# EAGLE design IR4427 (EAGLE 9.5.1)
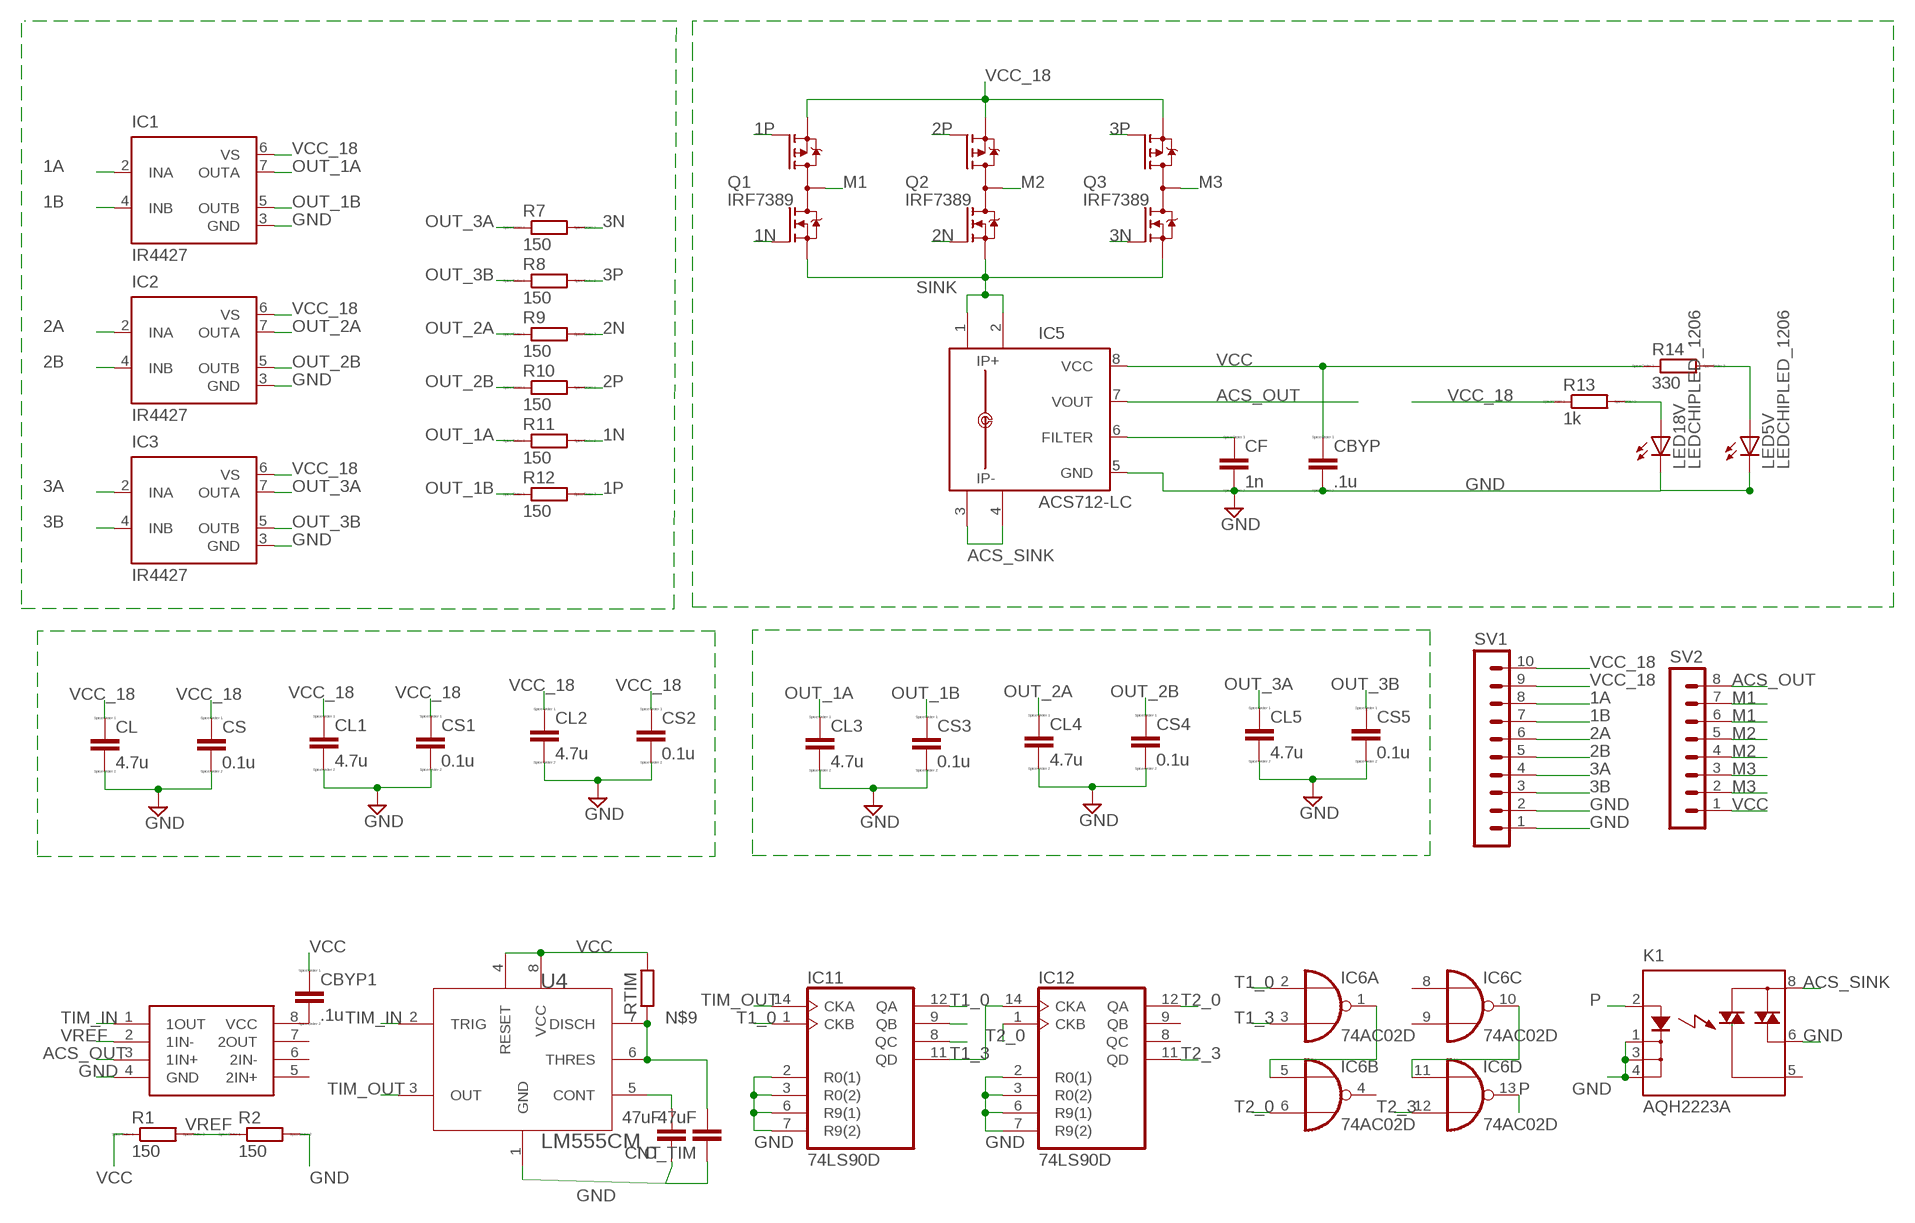
[diagram p0: schematic, sheet 1]

## Parts
C_TIM  47uF  C-EUC1206  [C1206]
CBYP  .1u  CC1206  [C1206]
CBYP1  .1u  CC1206  [C1206]
CF  1n  CC1206  [C1206]
CL  4.7u  CC1206  [C1206]
CL1  4.7u  CC1206  [C1206]
CL2  4.7u  CC1206  [C1206]
CL3  4.7u  CC1206  [C1206]
CL4  4.7u  CC1206  [C1206]
CL5  4.7u  CC1206  [C1206]
CNT  47uF  C-EUC1206  [C1206]
CS  0.1u  CC1206  [C1206]
CS1  0.1u  CC1206  [C1206]
CS2  0.1u  CC1206  [C1206]
CS3  0.1u  CC1206  [C1206]
CS4  0.1u  CC1206  [C1206]
CS5  0.1u  CC1206  [C1206]
IC1  IR4427  [DIL08]
IC2  IR4427  [DIL08]
IC3  IR4427  [DIL08]
IC5  ACS712-LC  [SOIC8]
IC6  74AC02D  [SO14]
IC11  74LS90D  [SO14]
IC12  74LS90D  [SO14]
K1  AQH2223A  [DIL07SMD]
LED5V  LEDCHIPLED_1206  [CHIPLED_1206]
LED18V  LEDCHIPLED_1206  [CHIPLED_1206]
Q1  IRF7389  [SO08-IRF]
Q2  IRF7389  [SO08-IRF]
Q3  IRF7389  [SO08-IRF]
R1  150  RR1206  [R1206]
R2  150  RR1206  [R1206]
R7  150  RR1206  [R1206]
R8  150  RR1206  [R1206]
R9  150  RR1206  [R1206]
R10  150  RR1206  [R1206]
R11  150  RR1206  [R1206]
R12  150  RR1206  [R1206]
R13  1k  RR1206  [R1206]
R14  330  RR1206  [R1206]
RTIM  R-EU_R1206  [R1206]
SV1  MA10-1  [MA10-1]
SV2  MA08-1  [MA08-1]
U1  LM293D  [8-SOIC]
U4  LM555CM  [SOIC-8N]

## Nets
1A [signal]: IC1.2(INA) SV1.8
1B [signal]: IC1.4(INB) SV1.7
1N [signal]: Q1.2(N-G) R11.2
1P [signal]: Q1.4(P-G) R12.2
2A [signal]: IC2.2(INA) SV1.6
2B [signal]: IC2.4(INB) SV1.5
2N [signal]: Q2.2(N-G) R9.2
2P [signal]: Q2.4(P-G) R10.2
3A [signal]: IC3.2(INA) SV1.4
3B [signal]: IC3.4(INB) SV1.3
3N [signal]: Q3.2(N-G) R7.2
3P [signal]: Q3.4(P-G) R8.2
ACS_OUT [signal]: IC5.7(VOUT) SV2.8 U1.3(1IN+)
ACS_SINK [gnd]: IC5.3(IP-) IC5.4(IP-1) K1.8(DS1)
GND [gnd]: C_TIM.1 CBYP.2 CF.2 CL1.2 CL2.2 CL3.2 CL4.2 CL5.2 CL.2 CNT.1 CS1.2 CS2.2 CS3.2 CS4.2 CS5.2 CS.2 IC1.3(GND) IC2.3(GND) IC3.3(GND) IC5.5(GND) IC11.2(R0(1)) IC11.3(R0(2)) IC11.6(R9(1)) IC11.7(R9(2)) IC12.2(R0(1)) IC12.3(R0(2)) IC12.6(R9(1)) IC12.7(R9(2)) K1.1(K) K1.3(K1) K1.4(K2) K1.6(DS3) LED5V.C LED18V.C R2.2 SV1.1 SV1.2 U1.4(GND) U4.1(GND)
M1 [motor]: Q1.5(D) Q1.6(D) Q1.7(D) Q1.8(D) SV2.6 SV2.7
M2 [motor]: Q2.5(D) Q2.6(D) Q2.7(D) Q2.8(D) SV2.4 SV2.5
M3 [motor]: Q3.5(D) Q3.6(D) Q3.7(D) Q3.8(D) SV2.2 SV2.3
N$2 [5v]: LED18V.A R13.2
N$3 [5v]: CF.1 IC5.6(FILTER)
N$4 [signal]: LED5V.A R14.2
N$8: IC6.1(A:O) IC6.5(B:I0)
N$9: RTIM.1 U4.7(DISCH)
N$15: IC6.10(C:O) IC6.11(D:I0)
N$16: CBYP1.2 U1.8(VCC)
N$31: CNT.2 U4.5(CONT)
N$34: C_TIM.2 U4.6(THRES)
N$40: IC11.9(QB)
N$42: IC11.8(QC)
OUT_1A [signal]: CL3.1 IC1.7(OUTA) R11.1
OUT_1B [signal]: CS3.1 IC1.5(OUTB) R12.1
OUT_2A [signal]: CL4.1 IC2.7(OUTA) R9.1
OUT_2B [signal]: CS4.1 IC2.5(OUTB) R10.1
OUT_3A [signal]: CL5.1 IC3.7(OUTA) R7.1
OUT_3B [signal]: CS5.1 IC3.5(OUTB) R8.1
P: IC6.13(D:O) K1.2(A)
SINK [signal]: IC5.1(IP+) IC5.2(IP+1) Q1.1(N-S) Q2.1(N-S) Q3.1(N-S)
T1_0: IC6.2(A:I0) IC11.1(CKB) IC11.12(QA)
T1_3 [signal]: IC6.3(A:I1) IC11.11(QD) IC12.14(CKA)
T2_0 [signal]: IC6.6(B:I1) IC12.1(CKB) IC12.12(QA)
T2_3 [signal]: IC6.12(D:I1) IC12.11(QD)
TIM_IN: U1.1(1OUT) U4.2(TRIG)
TIM_OUT: IC11.14(CKA) U4.3(OUT)
VCC [5v]: CBYP1.1 CBYP.1 IC5.8(VCC) R1.1 R14.1 RTIM.2 SV2.1 U4.4(RESET) U4.8(VCC)
VCC_18 [motor]: CL1.1 CL2.1 CL.1 CS1.1 CS2.1 CS.1 IC1.6(VS) IC2.6(VS) IC3.6(VS) Q1.3(P-S) Q2.3(P-S) Q3.3(P-S) R13.1 SV1.9 SV1.10
VREF: R1.2 R2.1 U1.2(1IN-)
Unconnected: IC6.4(B:O) IC6.8(C:I0) IC6.9(C:I1) IC12.8(QC) IC12.9(QB) K1.5(DS2) U1.5(2IN+) U1.6(2IN-) U1.7(2OUT)

## Power pins joined to a net without a drawn wire
GND: IC6.7(P:GND) IC11.10(GND) IC12.10(GND)
VCC: IC6.14(P:VCC) IC11.5(VCC) IC12.5(VCC)

## Library data of the parts
C_TIM CNT = rcl:C-EU: CAPACITOR, European symbol
CBYP CBYP1 CF CL CL1-CL5 CS CS1-CS5 = eagle-ltspice:C: CAPACITOR, European symbol; SPICEMODEL: NONE; SPICEPREFIX: C
IC1-IC3 = ir:IR4427: DUAL LOW SIDE DRIVER Source: ID4426.pdf; MF: INTERNATIONAL RECTIFIER(IR); MPN: IR4427; OC_FARNELL: 1023267; OC_NEWARK: 27C6914
IC5 = allegro-2:ACS712-LC
IC6 = 74xx-eu:74*02: Quad 2-input NOR gate
IC11 IC12 = 74xx-eu:74*90: Decade, divide by twelve and binary COUNTER
K1 = relay:AQH*223: SOLID STATE RELAY NAiS Source: http://www.mew-europe.com/.. en_ds_61613_0000.pdf; MF: AROMAT/ MATSUSHITA; MPN: AQH2223A; OC_FARNELL: unknown; OC_NEWARK: 26K3060
LED5V LED18V = audio amplifier example:LED
Q1-Q3 = transistor-fet:IRF7389: Complimentary Half Bridge HEXFET Power MOSFET Source: http://www.irf.com/product-info/datasheets/data/irf7389.pdf
R1 R2 R7-R14 = eagle-ltspice:R: RESISTOR, European symbol; SPICEMODEL: NONE; SPICEPREFIX: R
RTIM = resistor:R-EU_: RESISTOR, European symbol
SV1 = con-lstb:MA10-1: PIN HEADER; OC_FARNELL: unknown; OC_NEWARK: unknown
SV2 = con-lstb:MA08-1: PIN HEADER; OC_FARNELL: unknown; OC_NEWARK: unknown
U1 = IC:LM293D: IC COMPARATOR DIFF DUAL 8SOIC Manufacturer's datasheet <http://www.ti.com/general/docs/suppproductinfo.tsp?distId=10&gotoUrl=http%3A%2F%2Fwww.ti.com%2Flit%2Fgpn%2Flm293>; CREATED_BY: PCBLayout.com; DIGIKEY_PART_NUMBER: 296-9531-5-ND; MANUFACTURER: Texas Instruments; MPN: LM293D; PACKAGE: 8-SOIC
U4 = IC:LM555CM: IC OSC SINGLE TIMER 8-SOP Manufacturer's datasheet <https://www.onsemi.com/pub/Collateral/LM555-D.pdf>; CREATED_BY: PCBLayout.com; DIGI-KEY_PART: LM555CMFS-ND; MANUFACTURER: ON Semiconductor; MPN: LM555CM; PACKAGE: SOIC-8

## Net classes
0 18v: width 1.4 mm, drill 0.4 mm, clearance 0.152 mm
1 5v: width 0.4 mm, drill 0.4 mm, clearance 0.152 mm
2 motor: width 1.4 mm, drill 0.4 mm, clearance 0.152 mm
3 signal: width 0.3 mm, drill 0.4 mm, clearance 0.152 mm
4 gnd: width 1.4 mm, drill 0.4 mm, clearance 0.152 mm

## Board
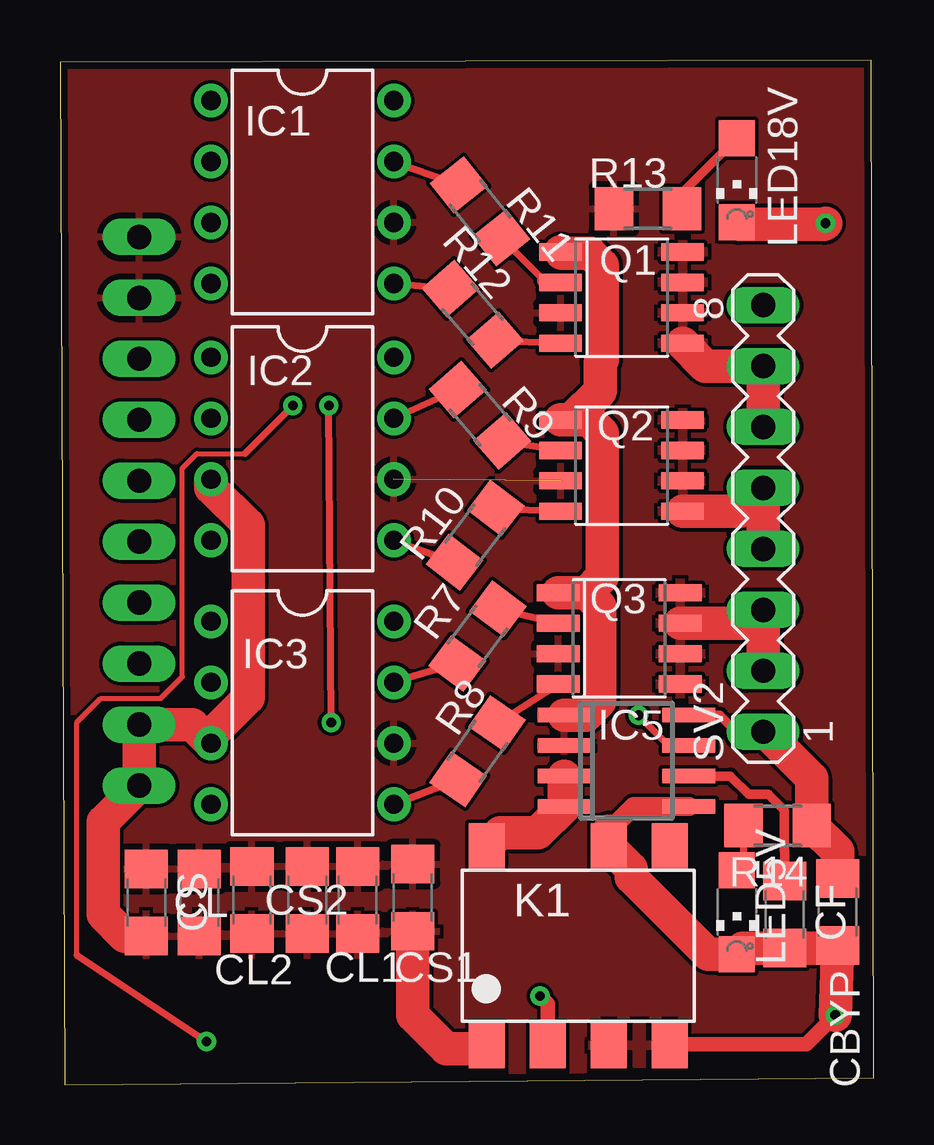
[diagram p1: board, top side]
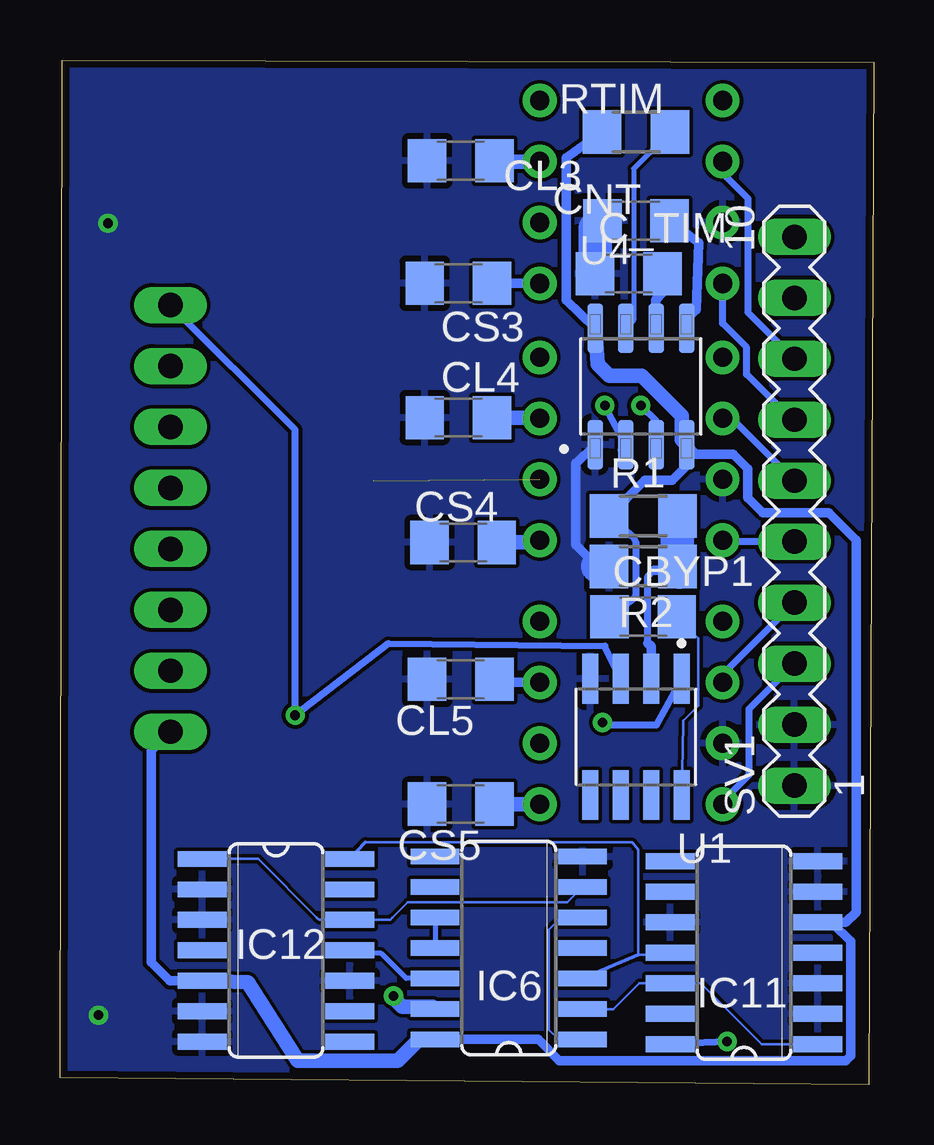
[diagram p2: board, bottom side, seen from below]

Size 33.9 x 42.7 mm. Coordinates in mm from the lower left corner, seen from the top.
Outline: 0.2,0 33.9,0.3 33.8,42.7 0,42.6 0.2,0
Copper layers (1*16): Top 0.035mm / dielectric 1.5mm / Bottom 0.035mm
Design rules "default *": minimum track width 6mil, minimum drill 0.35mm, track to track 6mil, track to pad 6mil, pad to pad 6mil, via to via 6mil, smd to smd 6mil, copper to edge 0.3mm, drill to drill 6mil, minimum pad ring 10mil, minimum via ring 8mil, stop-mask expansion 4mil, vias tented up to drill 0mil, thermal gap 10mil

### Footprints (pad centres in the part's own frame; a part is rotated, then mirrored left to right if it is on the bottom)
C1206 = smd 1.6 x 1.8: 1 -1.4,0; 2 1.4,0
DIL08 = drill 0.8 pad 1.4: 1 -3.81,-3.81; 2 -1.27,-3.81; 3 1.27,-3.81; 4 3.81,-3.81; 5 3.81,3.81; 6 1.27,3.81; 7 -1.27,3.81; 8 -3.81,3.81
SOIC8 = smd 0.6 x 2.2: 1 -1.905,-2.6; 2 -0.635,-2.6; 3 0.635,-2.6; 4 1.905,-2.6; 5 1.905,2.6; 6 0.635,2.6; 7 -0.635,2.6; 8 -1.905,2.6
SO14 = smd 0.66 x 2.032: 1 -3.81,-3.073; 2 -2.54,-3.073; 3 -1.27,-3.073; 4 0,-3.073; 5 1.27,-3.073; 6 2.54,-3.073; 7 3.81,-3.073; 8 3.81,3.073; 9 2.54,3.073; 10 1.27,3.073; 11 0,3.073; 12 -1.27,3.073; 13 -2.54,3.073; 14 -3.81,3.073
DIL07SMD = smd 1.5 x 1.9: 1 -3.81,-4.15; 2 -1.27,-4.15; 3 1.27,-4.15; 4 3.81,-4.15; 5 3.81,4.15; 6 1.27,4.15; 8 -3.81,4.15
CHIPLED_1206 = smd 1.5 x 1.5: A 0,-1.75; C 0,1.75
SO08-IRF = smd 0.72 x 1.78: 1 -1.905,-2.543; 2 -0.635,-2.543; 3 0.635,-2.543; 4 1.905,-2.543; 5 1.905,2.543; 6 0.635,2.543; 7 -0.635,2.543; 8 -1.905,2.543
R1206 = smd 1.6 x 1.803: 1 -1.422,0; 2 1.422,0
MA10-1 = drill 1.016 long: 1 -11.43,0; 2 -8.89,0; 3 -6.35,0; 4 -3.81,0; 5 -1.27,0; 6 1.27,0; 7 3.81,0; 8 6.35,0; 9 8.89,0; 10 11.43,0
MA08-1 = drill 1.016 long: 1 -8.89,0; 2 -6.35,0; 3 -3.81,0; 4 -1.27,0; 5 1.27,0; 6 3.81,0; 7 6.35,0; 8 8.89,0
8-SOIC = smd 0.66 x 2.07: 1 -1.905,-2.42; 2 -0.635,-2.42; 3 0.635,-2.42; 4 1.905,-2.42; 5 1.905,2.42; 6 0.635,2.42; 7 -0.635,2.42; 8 -1.905,2.42
SOIC-8N = smd 0.65 x 2.07: 1 -1.905,-2.425; 2 -0.635,-2.425; 3 0.635,-2.425; 4 1.905,-2.425; 5 1.905,2.425; 6 0.635,2.425; 7 -0.635,2.425; 8 -1.905,2.425

### Placement (x,y rotation side)
C_TIM  10.2,33.8 0 bottom
CBYP  32.4,7.2 270 top
CBYP1  9.6,19.5 0 bottom
CF  30.2,7.1 270 top
CL  5.8,7.6 270 top
CL1  12.4,7.7 270 top
CL2  8,7.7 270 top
CL3  17.2,38.5 180 bottom
CL4  17.3,27.8 180 bottom
CL5  17.2,16.9 180 bottom
CNT  9.9,36 0 bottom
CS  3.6,7.6 270 top
CS1  14.7,7.8 270 top
CS2  10.3,7.7 270 top
CS3  17.3,33.4 180 bottom
CS4  17.1,22.6 180 bottom
CS5  17.2,11.7 180 bottom
IC1  10.1,37.2 270 top
IC2  10.1,26.5 270 top
IC3  10.1,15.5 270 top
IC5  23.6,13.5 270 top
IC6  15.2,5.7 90 bottom
IC11  5.4,5.5 90 bottom
IC12  24.9,5.6 270 bottom
K1  21.6,5.8 0 top
LED5V  28.2,7.2 180 top
LED18V  28.2,37.7 180 top
Q1  23.4,32.8 270 top
Q2  23.4,25.8 270 top
Q3  23.3,18.6 270 top
R1  9.6,23.7 0 bottom
R2  9.6,21.6 180 bottom
R7  17.4,18.7 53.3 top
R8  17.4,13.9 55.3 top
R9  17.5,27.9 310.9 top
R10  17.3,22.9 52.6 top
R11  17.5,36.4 308.6 top
R12  17.2,32.1 310.7 top
R13  24.5,36.5 0 top
R14  29.9,10.8 180 top
RTIM  9.9,39.7 180 bottom
SV1  3.3,23.9 90 bottom
SV2  29.3,23.6 90 top
U1  9.9,14.5 180 bottom
U4  9.7,29.1 0 bottom

### Tracks (layer width: path | path; a pad name or v marks a point on that pad's centre or on a via)
1A
  Bottom 0.3: IC1.2 6.29,37.99 5.23,36.93 5.23,32.18 SV1.8
1B
  Bottom 0.3: SV1.7 3.4,27.71 5.29,29.6 5.29,30.73 6.29,31.73 IC1.4
1N
  Top 0.3: R11.2 20.18,33.5
  Top 0.6: Q1.2 20.8,33.5 20.18,33.5
1P
  Top 0.3: R12.2 Q1.4
2A
  Bottom 0.3: SV1.6 5.9,27.77 IC2.2
2B
  Bottom 0.3: SV1.5 6.23,22.63 IC2.4
2N
  Top 0.3: R9.2 Q2.2
2P
  Top 0.3: R10.2 Q2.4
3A
  Bottom 0.3: IC3.2 6.29,17.1 SV1.4
3B
  Bottom 0.3: SV1.3 5.2,15.65 5.2,12.9 6.29,11.81 IC3.4
3N
  Top 0.3: R7.2 Q3.2
3P
  Top 0.3: R8.2 Q3.4
  Top 0.6: Q3.4
ACS_OUT  (via drill 0.4)
  Top 0.3: v24.1,15.4 25.37,14.13 IC5.7 27.13,14.13
  Bottom 0.28: 11.19,18.28 20.22,18.38
  Bottom 0.3: SV2.8 24.1,27.29 v24.1,15.4 20.22,18.38 | U1.3 11.19,18.28
ACS_SINK
  Top 1.4: K1.8 18.34,10.5 19.91,10.5 IC5.4 IC5.3
GND  (via drill 0.4)
  Top 0.6: v32.3,2.9 31.1,1.7 25.46,1.7 K1.4
  Top 0.8: IC5.5 23.9,11.6 22.87,10.57
  Top 1.4: 22.87,10.57 K1.6 23.81,9.01 23.81,8.65 27.01,5.45 LED5V.C 28.45,5.7 CF.2 32.3,5.7 CBYP.2 v32.3,2.9 | CS1.2 14.7,2.9 16.1,1.5 17.64,1.5 K1.1 | CS.2 2.7,6.2 1.8,7.1 1.8,10.97 SV1.1 SV1.2 5.51,15.01 IC3.3 6.29,14.58 7.84,16.13 7.84,23.33 6.29,24.88 IC2.3 | v31.9,35.9 31.85,35.85 28.3,35.85 LED18V.C
  Bottom 0.4: U4.1 12.38,25.9 | 12.4,25.9 12.4,22.5 11.5,21.6
  Bottom 1.4: 11.5,21.6 R2.2 | CNT.1 11.6,35.7 C_TIM.1
  pour Top: 22.2,2.5 22.2,0.9 26.1,0.9 26.1,2.4 26,2.5
  pour Top: 2.7,6.9 2.7,5.5 2.8,5.4 15.4,5.4 15.7,5.7 15.7,6.9 15.5,7.1 2.8,7.1 2.7,7
  pour Bottom: -0.3,-0.5 35.5,-0.4 35.1,43.4 0.1,43.2 0,42.4 0,42.1 0,42
M1
  Top 1.4: Q1.5 26.89,29.95 SV2.7 SV2.6
  pour Top (rank 5): 25.1,34.9 25.1,30.8 25.4,30.5 26.4,30.5 26.6,30.5 26.8,30.7 26.8,34.8 26.6,35 25.3,35
M2
  Top 1.4: Q2.5 28.33,23.9 SV2.5 SV2.4
  pour Top (rank 4): 25.1,28 25.1,23.8 25.3,23.6 26.4,23.6 26.6,23.8 26.7,23.8 26.7,27.7 26.5,27.9 26.4,28 25.2,28
M3
  Top 1.4: Q3.7 28.75,19.23 SV2.3 SV2.2
  pour Top (rank 3): 25,20.8 25,16.4 25.1,16.3 26.6,16.3 26.7,16.4 26.7,20.7 26.5,20.9 25.1,20.9
N$2
  Top 0.4: LED18V.A 25.92,37.17 R13.2
N$3
  Top 0.4: IC5.6 27.94,12.87 28.7,12.1 29.5,12.1 30.17,11.43 30.17,9.75 30.2,9.72 CF.1
N$4
  Top 0.3: R14.2 28.48,9.23 LED5V.A
N$8
  Bottom 0.1: IC6.1 13.13,1.89 13.53,2.29 13.53,6.47 13.03,6.97 IC6.5
N$9
  Bottom 0.2: RTIM.1 10,38.18 10,31.86 U4.7
N$15
  Bottom 0.2: IC6.10 IC6.11
N$16
  Bottom 0.1: U1.8 7.94,15.03 7.94,15.16 7.3,15.8 7.3,18.6 CBYP1.2
N$31
  Bottom 0.4: U4.5 7.79,31.9 7.4,32.3 7.29,35.09 CNT.2
N$34
  Bottom 0.4: C_TIM.2 8.8,32.99 9.07,32.72 9.07,31.53 U4.6
OUT_1A
  Top 0.3: IC1.7 R11.1
  Bottom 0.6: CL3.1 15.77,38.47 IC1.7
OUT_1B
  Top 0.3: IC1.5 R12.1
  Bottom 0.4: IC1.5 CS3.1
OUT_2A
  Top 0.3: IC2.7 R9.1
  Bottom 0.6: CL4.1 13.94,27.8 IC2.7
OUT_2B
  Top 0.3: IC2.5 R10.1
  Bottom 0.6: CS4.1 14,22.6 IC2.5
OUT_3A
  Top 0.3: R7.1 IC3.7
  Bottom 0.3: 15.67,16.77 CL5.1
  Bottom 0.4: IC3.7 15.67,16.77
OUT_3B
  Top 0.3: IC3.5 R8.1
  Bottom 0.6: CS5.1 IC3.5
P  (via drill 0.4)
  Top 0.6: v20,3.7 20.33,3.37 K1.2
  Bottom 0.6: IC6.13 18.36,3.25 19.64,3.25 20,3.61 v20,3.7
SINK
  Top 1.4: Q3.1 21.94,20.51 | IC5.1 21.92,15.4 22.5,15.98 22.5,19.95 21.94,20.51 | 21.94,20.51 22.6,21.16 22.6,27.15 22.04,27.7 Q2.1 21.3,27.7 22.5,28.9 22.5,30.08 22.6,30.18 22.6,34.15 22.1,34.65 20.91,34.65 Q1.1
  pour Top (rank 2): 19.9,15.7 20,15.6 20,15.2 20.3,14.9 20.3,14.5 20.1,14.3 20,14.3 20,13.9 22,13.9 22.1,14 22.1,15.5 21.9,15.7 21.8,15.7
T1_0
  Bottom 0.1: IC11.1 4.65,1.69 7.19,4.23 8.4,4.23 | 8.6,4.23 9.77,4.23 10.85,3.15 12.11,3.15 IC6.2
  Bottom 0.2: 8.6,4.23 IC11.12 8.4,4.23
T1_3
  Bottom 0.1: 8.56,5.41 9.8,5.41 9.8,9.8 10.05,10.1 21.18,10.1
  Bottom 0.15: IC6.3 9.8,5.41 | 21.18,10.1 IC12.14
  Bottom 0.2: IC11.11 8.56,5.41
T2_0
  Bottom 0.1: IC12.1 25.65,9.41 23.2,6.96 23.11,6.87 IC12.12 20.15,6.87 20.06,6.96 19.41,7.6 12.76,7.6 IC6.6
T2_3
  Bottom 0.2: IC6.12 19.47,4.43 20.54,5.5 21.73,5.5 IC12.11
TIM_IN  (via drill 0.4)
  Top 0.3: v11.3,15.1 v11.2,28.3
  Bottom 0.2: 10.56,26.45 U4.2
  Bottom 0.3: U4.2 v11.2,28.3 | U1.1 9.05,15 11.2,15 v11.3,15.1
TIM_OUT  (via drill 0.4)
  Top 0.2: 0.7,5.4 0.7,15.1 1.7,16.1 4.2,16.1 5.1,17 5.1,25.7 5.7,26.3 7.7,26.3
  Top 0.3: 7.7,26.3 v9.7,28.3 | v6.1,1.8 0.7,5.4
  Bottom 0.3: v9.7,28.3 9.06,27.66 U4.3 | v6.1,1.8 IC11.14
VCC
  Top 0.4: SV2.1 29.23,14.64 28.27,14.64 28.2,14.7 | 28.2,14.7 28.15,14.7 | IC5.8 27.5,15.4 28.2,14.7
  Top 0.6: 31.4,10.88 R14.1
  Top 1.4: SV2.1 29.39,14.71 31.32,12.78 R14.1 32.4,9.72 CBYP.1
  Bottom 0.3: R1.1 10,22.8 9.9,22.6 9.9,20.33 CBYP1.1
  Bottom 0.4: R1.1 9.53,25.19 8.39,25.19 7.79,25.79 7.79,26.67 U4.4 7.4,26.28 5.85,26.28 5.24,25.67 5.24,24.47 4.61,23.84 1.88,23.84 0.72,22.69 0.72,7.2 1.15,6.77 IC11.5 1.7,6.8 1.7,6.72 0.96,5.98 0.96,1.21 1.16,1.01 13.09,1.01 13.97,1.89 IC6.14 | IC12.5 29.33,4.33 30.1,5.1 30.1,13.91 SV2.1 | U4.8 12.8,32.7 12.8,38.63 RTIM.2
  Bottom 0.6: IC6.14 18.94,1.89 19.82,1.01 23.99,1.01 24,1 26.09,4.28 IC12.5 | U4.4 7.99,26.87 7.99,27.87 9.65,29.54 11.02,29.54 11.5,30.02 U4.8
VCC_18  (1 unrouted)
  pour Top (rank 6): -0.6,43.3 -0.7,-1.2 36.1,-1.2 35.8,44 -0.2,43.8 -0.6,43.2
VREF
  Bottom 0.3: 9.4,18.4 9.4,21.2 9.17,21.43
  Bottom 0.4: U1.2 9.26,18.27 9.4,18.4 | 9.17,21.43 8.18,21.43
  Bottom 1.4: R1.2 R2.1 8.18,21.43 8.1,21.35